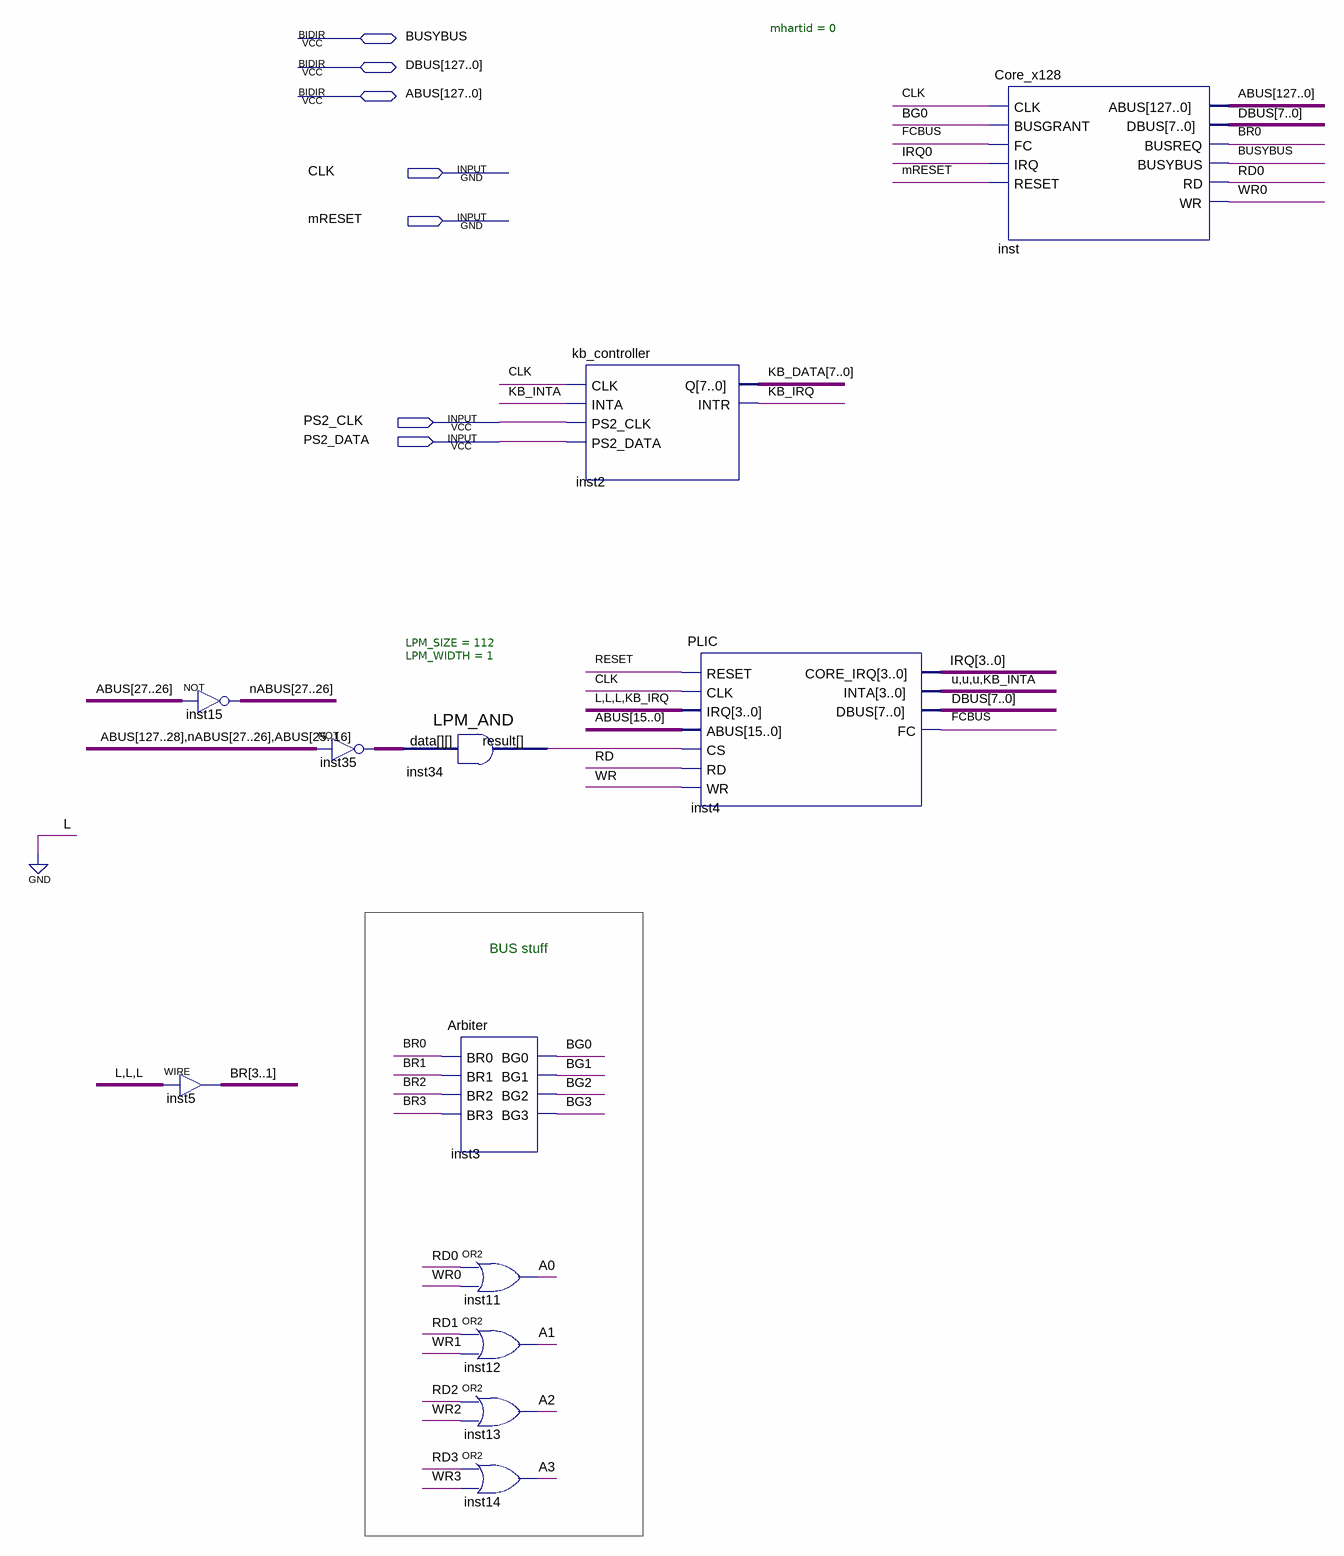
[diagram p0: schematic sheet]
// Quartus schematic TLE.bdf as structural Verilog: 12 symbols, 7 pins
module TLE (
  input  CLK,
  input  mRESET,
  input  PS2_CLK,
  input  PS2_DATA,
  inout  BUSYBUS,
  inout  [127:0] DBUS,
  inout  [127:0] ABUS
);

  wire A0, A1, A2, A3, BG0, BG1, BG2, BG3, BR0, FCBUS, inst34_result, KB_INTA, KB_IRQ, RD, RD0, RD1, RD2,
       RD3, RESET, u, WR, WR0, WR1, WR2, WR3;
  wire [3:0] IRQ;
  wire [3:1] BR;
  wire [7:0] KB_DATA;
  wire [27:26] nABUS;
  wire [111:0] inst35_out;

  assign nABUS = ~ABUS[27:26];  // NOT inst15, 2 bits wide
  assign BR = 3'b000;  // WIRE inst5
  assign inst35_out = ~{ABUS[127:28], nABUS, ABUS[25:16]};  // NOT inst35, 112 bits wide
  LPM_AND #(.LPM_SIZE(112), .LPM_WIDTH(1)) inst34 (.data(inst35_out), .result(inst34_result));
  Arbiter inst3 (.BR0(BR0), .BR1(BR[1]), .BR2(BR[2]), .BR3(BR[3]), .BG0(BG0), .BG1(BG1), .BG2(BG2), .BG3(BG3));
  or inst11 (A0, RD0, WR0);
  or inst12 (A1, RD1, WR1);
  or inst13 (A2, RD2, WR2);
  or inst14 (A3, RD3, WR3);
  kb_controller inst2 (.CLK(CLK), .INTA(KB_INTA), .PS2_CLK(PS2_CLK), .PS2_DATA(PS2_DATA), .Q(KB_DATA), .INTR(KB_IRQ));
  PLIC inst4 (
    .RESET(RESET), .CLK(CLK), .IRQ({3'b000, KB_IRQ}), .ABUS(ABUS[15:0]), .CS(inst34_result), .RD(RD),
    .WR(WR), .CORE_IRQ(IRQ), .INTA({{3{u}}, KB_INTA}), .FC(FCBUS), .DBUS(DBUS[7:0]));
  Core_x128 #(.mhartid(0)) inst (
    .CLK(CLK), .BUSGRANT(BG0), .FC(FCBUS), .IRQ(IRQ[0]), .RESET(mRESET), .ABUS(ABUS), .BUSREQ(BR0), .RD(RD0),
    .WR(WR0), .DBUS(DBUS[7:0]), .BUSYBUS(BUSYBUS));

  // Notes on the sheet:
  //   BUS stuff
endmodule
